# EAGLE design ExternalMotorControllerRev5 (EAGLE 6.4)

## Sheet 1 of 7
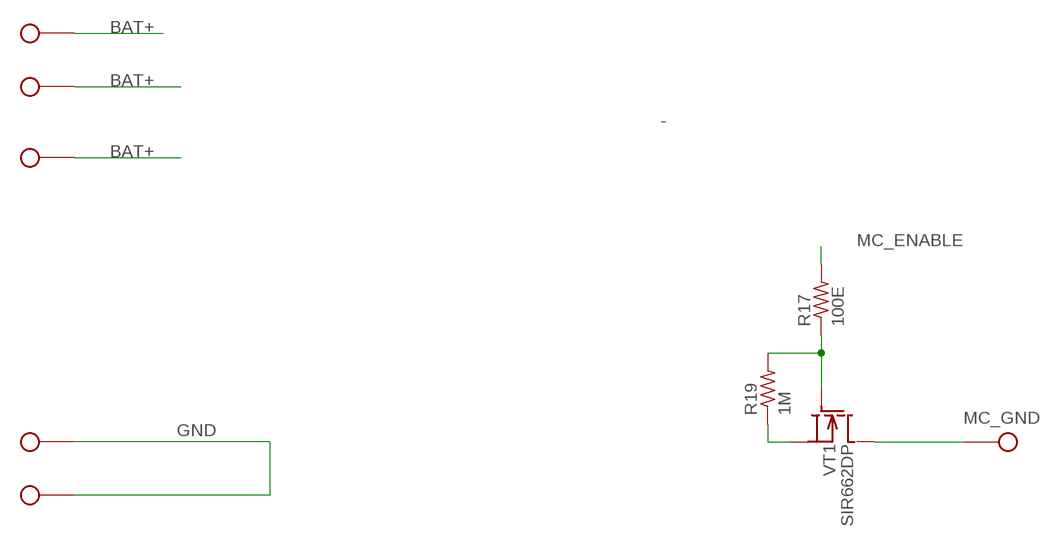
[diagram p0: schematic, sheet 1]

### Parts
R17  100E  R-US_R0402  [R0402]
R19  1M  R-US_R0402  [R0402]
VT1  SIR662DP  [POWERPAK_SO8]
X1  SOLDER_HOLE18AWG  [SOLDER_HOLE_18]
X2  SOLDER_HOLE18AWG  [SOLDER_HOLE_18]
X3  SOLDER_HOLE18AWG  [SOLDER_HOLE_18]
X4  SOLDER_HOLE18AWG  [SOLDER_HOLE_18]
X5  SOLDER_HOLE18AWG  [SOLDER_HOLE_18]
X13  SOLDER_HOLE18AWG  [SOLDER_HOLE_18]

### Nets
BAT+: X1.1 X3.1 X4.1 ; also sheet 3,7
GND: R19.1 VT1.S1(S) VT1.S2(S) VT1.S3(S) X5.1 X13.1 ; also sheet 2,3,7
MC_ENABLE: R17.2 ; also sheet 7
MC_GND: VT1.D X2.1 ; also sheet 7
N$25: R17.1 R19.2 VT1.G

## Sheet 2 of 7
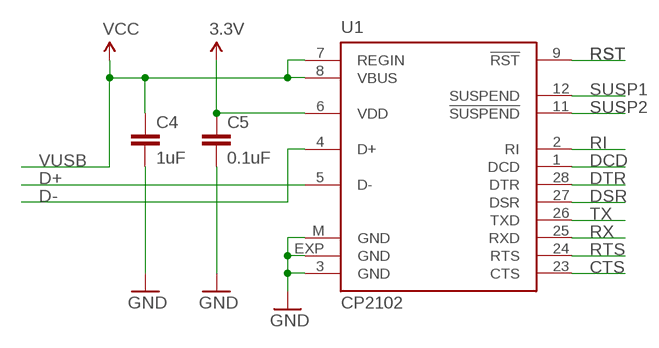
[diagram p1: schematic, sheet 2]

### Parts
C4  1uF  CAP0402  [C0402]
C5  0.1uF  CAP0402  [C0402]
U1  CP2102  CP210X_USB_UART  [MLP28]

### Nets
3.3V: C5.1 U1.6(VDD)
CTS: U1.23(CTS)
D+: U1.5(D-)
D-: U1.4(D+)
DCD: U1.1(DCD)
DSR: U1.27(DSR)
DTR: U1.28(DTR) ; also sheet 7
GND: C4.2 C5.2 U1.3(GND) U1.EXP(GND) U1.M(GND) ; also sheet 1,3,7
RI: U1.2(RI)
RST: U1.9(!RST)
RTS: U1.24(RTS)
RX: U1.25(RXD) ; also sheet 7
SUSP1: U1.12(SUSPEND)
SUSP2: U1.11(!SUSPEND)
TX: U1.26(TXD) ; also sheet 7
VUSB: C4.1 U1.7(REGIN) U1.8(VBUS) ; supply symbol labelled VCC ; also sheet 7

## Sheet 3 of 7
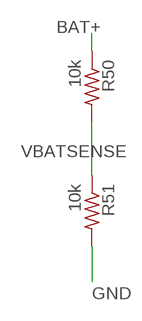
[diagram p2: schematic, sheet 3]

### Parts
R50  10k  R-US_R0402  [R0402]
R51  10k  R-US_R0402  [R0402]

### Nets
BAT+: R50.1 ; also sheet 1,7
GND: R51.2 ; also sheet 1,2,7
VBATSENSE: R50.2 R51.1 ; also sheet 7

## Sheet 4 of 7

## Sheet 5 of 7

## Sheet 6 of 7

## Sheet 7 of 7
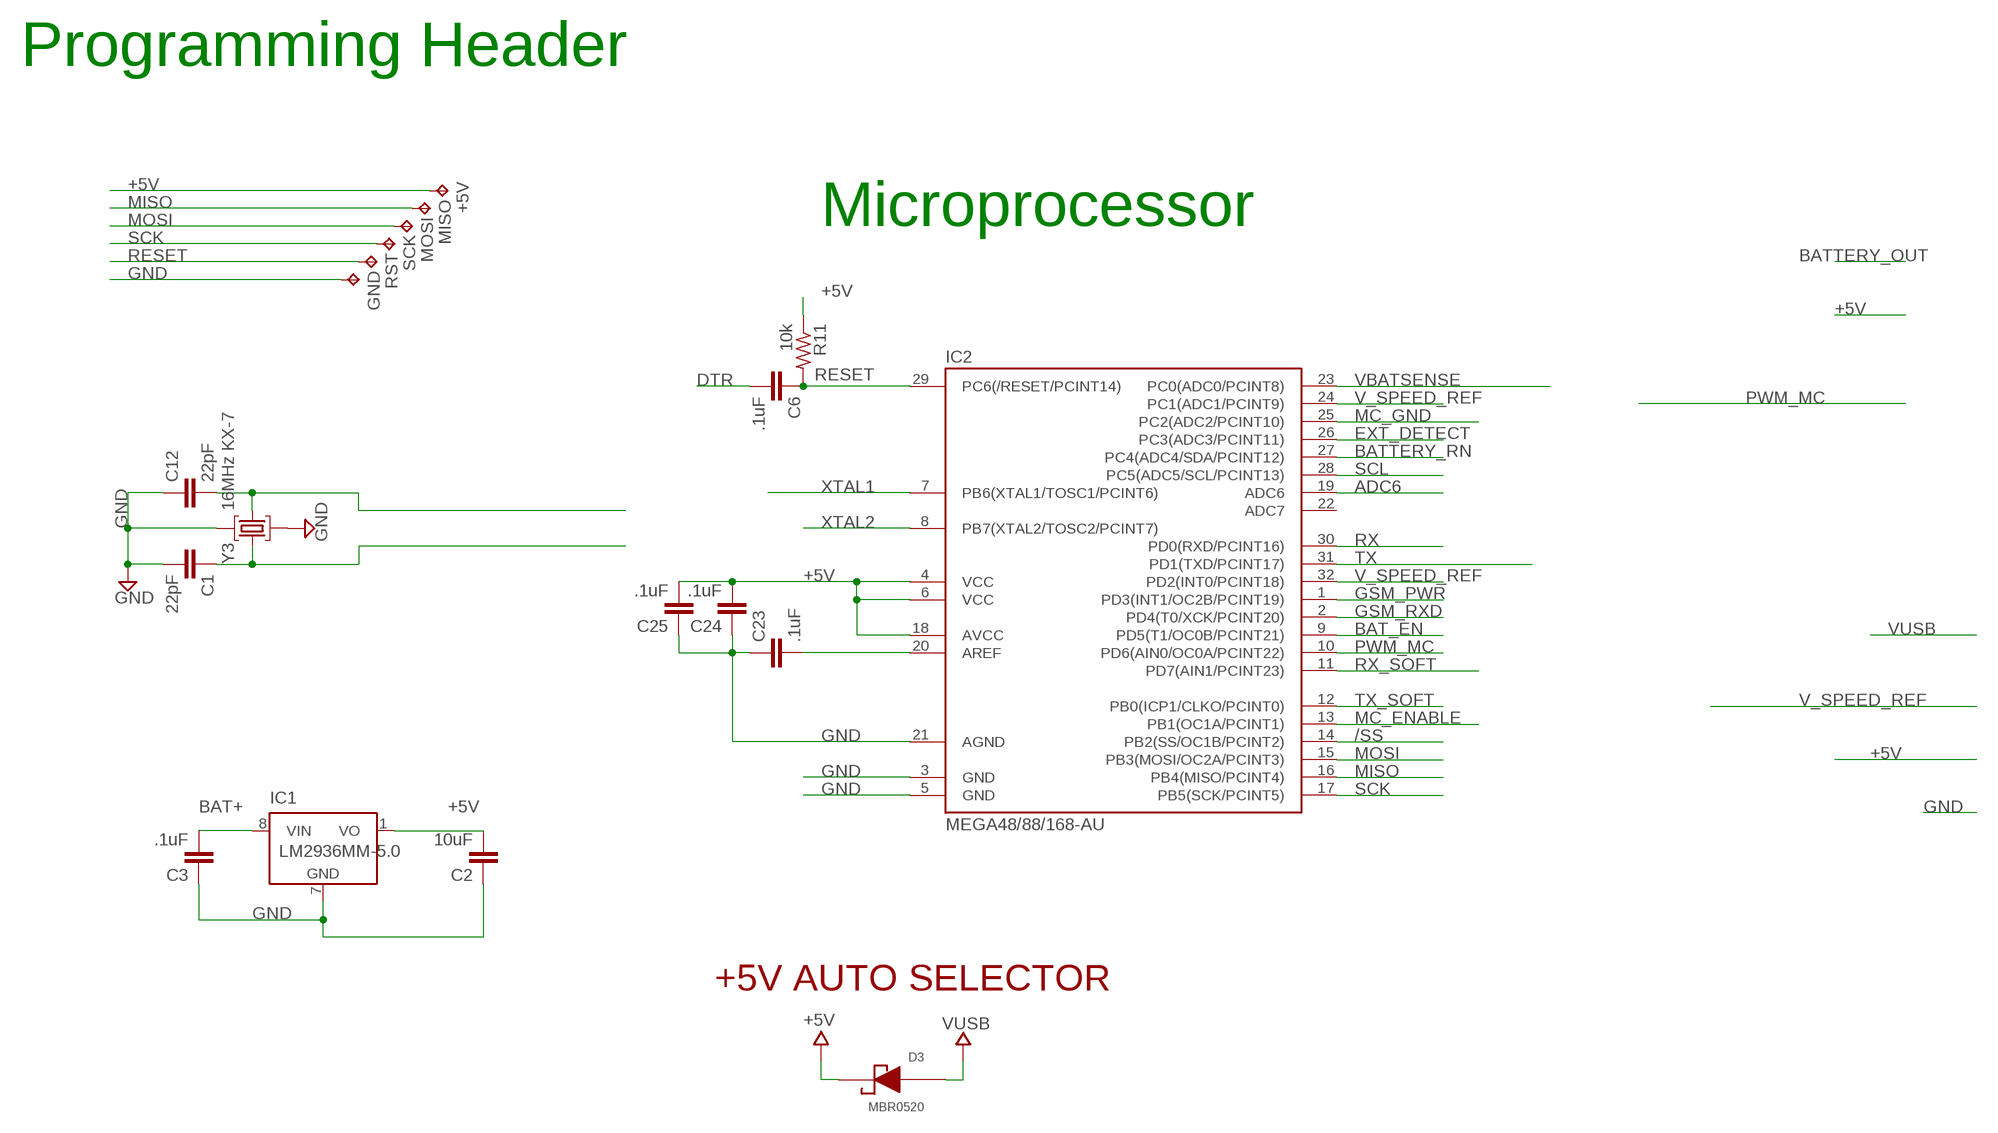
[diagram p3: schematic, sheet 7]

### Parts
+5V  TPTP08R  [TP08R]
C1  22pF  C-EUC0402  [C0402]
C2  10uF  C-EUC0805  [C0805]
C3  .1uF  C-EUC0402  [C0402]
C6  .1uF  C-EUC0402  [C0402]
C12  22pF  C-EUC0402  [C0402]
C23  .1uF  C-EUC0402  [C0402]
C24  .1uF  C-EUC0402  [C0402]
C25  .1uF  C-EUC0402  [C0402]
D3  MBR0520  [SOD-123]
GND  TPTP10R  [TP10R]
IC1  LM2936MM-5.0  [MINI-SO8]
IC2  MEGA48/88/168-AU  [TQFP32-08]
MISO  TPTP08R  [TP08R]
MOSI  TPTP08R  [TP08R]
R11  10k  R-US_R0402  [R0402]
RST  TPTP10R  [TP10R]
SCK  TPTP08R  [TP08R]
Y3  16MHz KX-7  CRYSTAL-3.2-2.5  [CRYSTAL-3.2-2.5]

### Nets
+5V: +5V.TP C2.2 C24.2 C25.2 D3.1(CA) IC1.1(VO) IC2.4(VCC) IC2.6(VCC) IC2.18(AVCC) R11.1
/SS: IC2.14(PB2(SS/OC1B/PCINT2))
ADC6: IC2.19(ADC6)
BAT+: C3.2 IC1.8(VIN) ; also sheet 1,3
BAT_EN: IC2.9(PD5(T1/OC0B/PCINT21))
BATTERY_RN: IC2.27(PC4(ADC4/SDA/PCINT12))
DTR: C6.2 ; also sheet 2
EXT_DETECT: IC2.26(PC3(ADC3/PCINT11))
GND: C1.2 C2.1 C3.1 C12.1 C23.1 C24.1 C25.1 GND.TP IC1.7(GND) IC2.3(GND) IC2.5(GND) IC2.21(AGND) Y3.2(GND) Y3.4(GND) ; also sheet 1,2,3
GSM_PWR: IC2.1(PD3(INT1/OC2B/PCINT19))
GSM_RXD: IC2.2(PD4(T0/XCK/PCINT20))
MC_ENABLE: IC2.13(PB1(OC1A/PCINT1)) ; also sheet 1
MC_GND: IC2.25(PC2(ADC2/PCINT10)) ; also sheet 1
MISO: IC2.16(PB4(MISO/PCINT4)) MISO.TP
MOSI: IC2.15(PB3(MOSI/OC2A/PCINT3)) MOSI.TP
N$36: C23.2 IC2.20(AREF)
PWM_MC: IC2.10(PD6(AIN0/OC0A/PCINT22))
RESET: C6.1 IC2.29(PC6(/RESET/PCINT14)) R11.2 RST.TP
RX: IC2.30(PD0(RXD/PCINT16)) ; also sheet 2
RX_SOFT: IC2.11(PD7(AIN1/PCINT23))
SCK: IC2.17(PB5(SCK/PCINT5)) SCK.TP
SCL: IC2.28(PC5(ADC5/SCL/PCINT13))
TX: IC2.31(PD1(TXD/PCINT17)) ; also sheet 2
TX_SOFT: IC2.12(PB0(ICP1/CLKO/PCINT0))
V_SPEED_REF: IC2.24(PC1(ADC1/PCINT9)) IC2.32(PD2(INT0/PCINT18))
VBATSENSE: IC2.23(PC0(ADC0/PCINT8)) ; also sheet 3
VUSB: D3.2(AN) ; also sheet 2
XTAL1: C12.2 IC2.7(PB6(XTAL1/TOSC1/PCINT6)) Y3.1(C1)
XTAL2: C1.1 IC2.8(PB7(XTAL2/TOSC2/PCINT7)) Y3.3(C2)
Unconnected: IC2.22(ADC7)

### Notes on the sheet
- Programming Header
- Microprocessor
- +5V AUTO SELECTOR

## Library data of the parts
+5V GND MISO MOSI RST SCK = testpad:TP: Test pad
C1-C3 C6 C23-C25 = rcl:C-EU: CAPACITOR, European symbol
C4 C5 = SparkFun:CAP: Capacitor Standard 0603 ceramic capacitor, and 0.1" leaded capacitor.
C12 = SmartPrj:C-EU: CAPACITOR, European symbol
D3 = MySMD:MBR0520
IC1 = national-semiconductor:LM2936?*: Ultra-Low Quiescent Current LDO Voltage Regulator Source: Data sheet <http://www.national.com/ds/LM/LM2936.pdf>; MF: NATIONAL SEMICONDUCTOR; MPN: LM2936MM-5.0/NOPB; OC_FARNELL: 1312707; OC_NEWARK: 41K4518
IC2 = avr-5:MEGA48/88/168
R11 R50 R51 = rcl:R-US_: RESISTOR, American symbol
R17 R19 = ForBattery:R-US_: RESISTOR, American symbol
U1 = SparkFun:CP210X_USB_UART: Single-Chip USB to UART Bridge Source: www.silabs.com .. CP2101.pdf / cp2102.pdf. Spark Fun Electronics SKU : COM-00310
VT1 = ForBattery:SIR662DP
X1-X5 X13 = ForBattery:SOLDER_HOLE
Y3 = SmartPrj:CRYSTAL-3.2-2.5

## Board
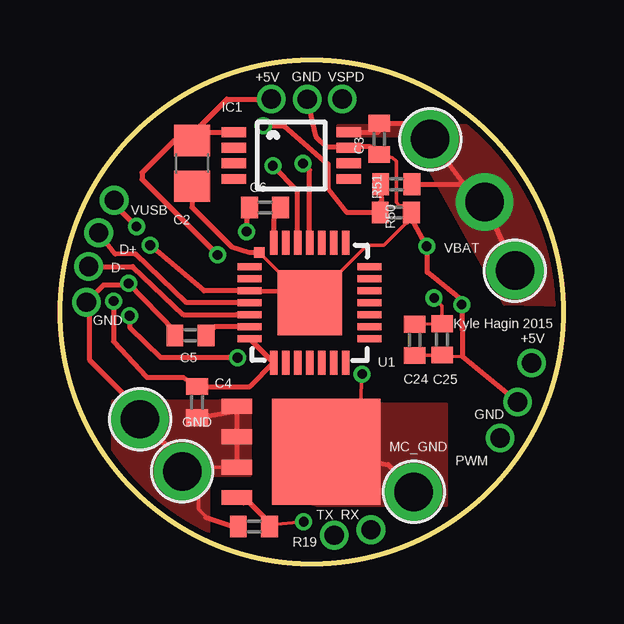
[diagram p4: board, top side]
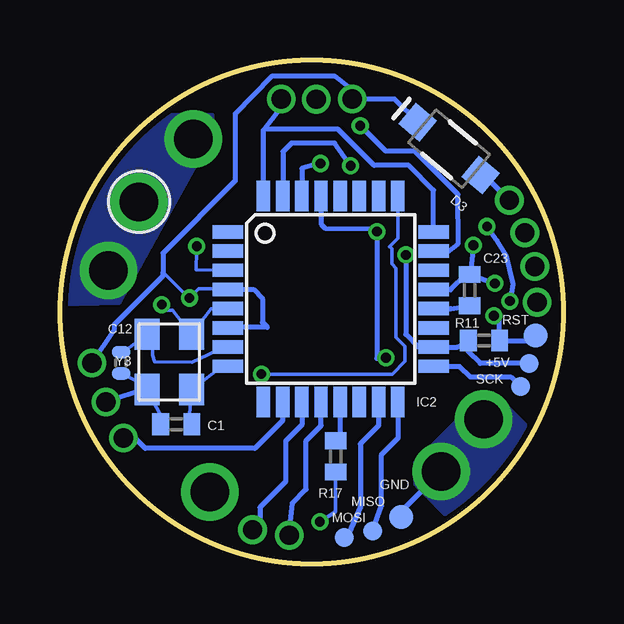
[diagram p5: board, bottom side, seen from below]

Size 21 x 21 mm. Coordinates in mm from the lower left corner, seen from the top.
Outline: circle at 10.5,10.5 radius 10.5
Copper layers (1*16): Top 0.035mm / dielectric 1.5mm / Bottom 0.035mm
Design rules "default *": minimum track width 6mil, minimum drill 16mil, track to track 6mil, track to pad 6mil, pad to pad 6mil, via to via 6mil, smd to smd 6mil, copper to edge 10mil, drill to drill 8mil, minimum pad ring 6mil, minimum via ring 6mil, stop-mask expansion 4mil, vias tented up to drill 15mil, thermal gap 10mil

### Footprints (pad centres in the part's own frame; a part is rotated, then mirrored left to right if it is on the bottom)
TP08R = smd 0.8 x 0.8: TP 0,0
C0402 = smd 0.7 x 0.9: 1 -0.65,0; 2 0.65,0
C0805 = smd 1.3 x 1.5: 1 -0.95,0; 2 0.95,0
C0402' = smd 0.508 x 0.762: 1 -0.445,0; 2 0.445,0
SOD-123 = smd 1.143 x 1.143: 1 0,0; 2 3.429,0
TP10R = smd 1 x 1: TP 0,0
MINI-SO8 = smd 0.41 x 1.02: 1 -0.975,-2.4; 2 -0.325,-2.4; 3 0.325,-2.4; 4 0.975,-2.4; 5 0.975,2.4; 6 0.325,2.4; 7 -0.325,2.4; 8 -0.975,2.4
TQFP32-08 = smd 1.27 x 0.559: 1 -4.293,2.8; 2 -4.293,2; 3 -4.293,1.2; 4 -4.293,0.4; 5 -4.293,-0.4; 6 -4.293,-1.2; 7 -4.293,-2; 8 -4.293,-2.8; 17 4.293,-2.8; 18 4.293,-2; 19 4.293,-1.2; 20 4.293,-0.4; 21 4.293,0.4; 22 4.293,1.2; 23 4.293,2; 24 4.293,2.8 | smd 0.559 x 1.27: 9 -2.8,-4.293; 10 -2,-4.293; 11 -1.2,-4.293; 12 -0.4,-4.293; 13 0.4,-4.293; 14 1.2,-4.293; 15 2,-4.293; 16 2.8,-4.293; 25 2.8,4.293; 26 2,4.293; 27 1.2,4.293; 28 0.4,4.293; 29 -0.4,4.293; 30 -1.2,4.293; 31 -2,4.293; 32 -2.8,4.293
R0402 = smd 0.7 x 0.9: 1 -0.65,0; 2 0.65,0
MLP28 = smd 1 x 0.3: 1 -2.5,1.5; 2 -2.5,1; 3 -2.5,0.5; 4 -2.5,0; 5 -2.5,-0.5; 6 -2.5,-1; 7 -2.5,-1.5; 15 2.5,-1.5; 16 2.5,-1; 17 2.5,-0.5; 18 2.5,0; 19 2.5,0.5; 20 2.5,1; 21 2.5,1.5 | smd 0.3 x 1: 8 -1.5,-2.5; 9 -1,-2.5; 10 -0.5,-2.5; 11 0,-2.5; 12 0.5,-2.5; 13 1,-2.5; 14 1.5,-2.5; 22 1.5,2.5; 23 1,2.5; 24 0.5,2.5; 25 0,2.5; 26 -0.5,2.5; 27 -1,2.5; 28 -1.5,2.5 | smd 2.7 x 2.7: EXP 0,0 | smd 0.435 x 0.435: M -2.103,2.103
POWERPAK_SO8 = smd 4.52 x 4.42: D 3.715,0 | smd 1.27 x 0.61: G 0,-1.905; S1 0,1.905; S2 0,0.635; S3 0,-0.635
SOLDER_HOLE_18 = drill 1.6: 1 0,0
CRYSTAL-3.2-2.5 = smd 1.3 x 1.05: 1 -1.15,-0.925; 2 1.15,-0.925; 3 1.15,0.925; 4 -1.15,0.925

### Placement (x,y rotation side)
+5V  1.43,8.36 0 bottom
C1  16.15,5.82 180 bottom
C2  5.51,16.69 90 top
C3  13.31,17.71 90 top
C4  5.72,6.74 270 top
C5  5.44,9.53 180 top
C6  8.55,14.85 0 top
C12  22pF  [C0402']  18.45,8.38 90 bottom
C23  3.91,11.41 270 bottom
C24  14.8,9.34 90 top
C25  15.93,9.36 90 top
D3  6.08,18.41 320 bottom
GND  6.78,1.95 0 bottom
IC1  9.64,17.02 270 top
IC2  9.71,11.04 0 bottom
MISO  7.96,1.37 0 bottom
MOSI  9.15,1.1 0 bottom
R11  3.31,9.31 0 bottom
R17  9.5,4.48 90 bottom
R19  8.09,1.57 0 top
R50  14.03,15.82 180 top
R51  14,14.64 0 top
RST  1.17,9.52 0 bottom
SCK  1.8,7.39 0 bottom
U1  10.41,10.88 0 top
VT1  7.38,4.67 0 top
X1  15.44,17.7 0 top
X2  14.75,3 0 top
X3  17.71,15.09 0 bottom
X4  18.98,12.23 0 top
X5  5.1,3.86 0 top
X13  3.34,6.03 0 top
Y3  16.44,8.42 270 bottom

### Tracks (layer width: path | path; a pad name or v marks a point on that pad's centre or on a via)
3.3V
  Top 0.203: U1.6 6.45,9.88 C5.1
+5V  (via drill 0.41, 0.8)
  Top 0.152: C24.2 15.85,10.01 C25.2 15.93,10.76 v15.6,11.08
  Top 0.203: 8.82,19.44 v8.81,19.37 6.96,19.37 5.58,18 | v6.58,12.88 3.43,16.03 3.43,16.3 4.76,17.64 C2.2 5.51,17.92 5.58,18 | 5.58,18 IC1.1
  Bottom 0.152: v8.81,19.37 8.87,19.8 | 16.7,12.15 15.64,11.08 v15.6,11.08 15.22,11.47 14.03,11.47 IC2.4
  Bottom 0.203: +5V.TP 3.48,8.36 3.97,8.85 3.97,9.42 R11.1 4.43,9.04 IC2.18 6.05,9.04 6.58,9.56 v6.58,12.88 | IC2.6 13.99,9.85 12.35,9.85 12.56,10.07 12.56,11.06 12.94,11.44 IC2.4 | 8.87,19.8 9.52,20.32 12.19,20.32 13.7,18.77 13.7,15.96 16.7,12.96 16.7,12.15 16.7,12 18.72,9.98 18.72,9.78 v19.66,8.38 | D3.1 7.05,19.37 v8.81,19.37
BAT+
  Top 0.152: 16.76,15.82 16.78,15.9
  Top 0.203: IC1.8 13.28,17.99 C3.2 14.79,18.36 X1.1 16.78,15.9 16.78,15.49 X3.1 18.98,12.17 X4.1 | R50.1 16.76,15.82
  pour Top (no thermals): 18.54,10.85 14.63,17.85 11.6,17.85 11.59,18.27 21.9,18.28 21.87,10.76
  pour Bottom (no thermals): 18.54,10.87 14.63,17.88 14.64,17.89 14.64,18.72 21.87,18.71 21.87,10.79
D+  (via drill 0.8)
  Top 0.203: v1.2,12.4 3.04,12.4 5.14,10.39 7.36,10.39 U1.5
D-  (via drill 0.8)
  Top 0.203: U1.4 5.27,10.89 3.13,12.92 2.31,12.92 v1.62,13.8
DTR
  Top 0.203: U1.28 8.94,14.71 C6.2
GND  (via drill 0.41, 0.8)
  Top 0.152: U1.M 9.92,11.36 | C3.1 13.87,16.92 14.03,16.79 14.03,15.08 14.16,14.93 14.67,14.93 R51.2 14.72,14.83 14.72,14.31 14.65,14.38 14.54,14.27 14.43,14.19 13.51,13.27 12.81,13.27 U1.EXP | R19.1 7.16,1.57 | 6.09,1.93 6.12,1.95 5.79,2.29 5.79,3.17 X5.1 5.27,4.03 VT1.S3 | 15.23,13.36 v15.3,13.24 15.32,13.25 | 16.97,10.83 v16.75,10.81 | 16.77,8.65 15.81,8.63 C25.1 14.95,8.71 C24.1
  Top 0.203: VT1.S3 VT1.S2 VT1.S1 7.3,6.35 C4.2 | X5.1 5.17,3.93 5.17,4.2 X13.1 3.34,6.72 3.01,6.72 1.24,8.49 1.24,10.77 v1.1,10.91 1.82,11.62 2.98,11.62 3.11,11.48 | 4.79,9.84 C5.2 4.79,9.7 v2.86,11.69 | v2.86,11.69 3.11,11.48 | 13.52,17.09 13.52,16.92 C3.1 13.41,16.92 12.96,17.38 12.08,17.38 IC1.7 12.01,17.38 11.12,17.38 10.66,17.83 v10.31,19.37 | v2.86,11.69 2.8,11.63 3.11,11.48 | U1.EXP 9.92,11.36 U1.3 6.01,11.38 v3.76,13.28 | 14.76,14.92 R51.2 | C2.1 5.51,14.86 7.15,13.22 7.89,12.99 U1.M | 7.16,1.57 6.09,1.93 | 15.23,13.36 14.65,14.38 | 16.97,10.83 15.32,12.15 15.32,13.25 | v16.75,10.81 16.77,8.65 v19.09,6.75
  Bottom 0.152: C1.2 16.77,6.15 Y3.2 17.36,7.3 17.36,7.4 C12.1 | IC2.5 14.7,10.64 Y3.4 | 15.71,9.91 Y3.4 | 15.31,13.29 v15.3,13.24 15.3,13.06 15.31,12.26 14.42,12.24 IC2.3 | 16.7,10.81 v16.75,10.81 16.54,10.58 16.29,10.58 Y3.4
  Bottom 0.203: GND.TP 6.78,2.18 X5.1 | C23.1 4.07,12.06 4.71,11.42 5.4,11.42 IC2.21 | 1.31,11.12 v1.1,10.91 | C23.1 v2.86,11.69 | v3.76,13.28 3.9,12.08 C23.1 | 17.36,7.3 v19.09,6.75
  pour Top (no thermals): 6.21,-0.26 6.21,3.7 7.92,3.7 7.92,6.79 2.19,6.79 2.19,-0.2 4.81,-0.2
  pour Bottom (no thermals): 2.93,7.12 3.32,7.12 6.21,4.23 6.21,3.31 4.5,1.61 3.55,1.61 1.27,3.89 1.27,5.5 2.75,6.97
MC_ENABLE
  Bottom 0.203: IC2.13 9.31,5.32 R17.2
MC_GND  (via drill 0.41)
  Top 0.152: VT1.D 11.1,6.27 12.51,6.26 v12.6,7.91
  Top 0.203: VT1.D 13.68,4.14 X2.1
  Bottom 0.152: IC2.25 6.91,13.57 7.27,13.21 7.23,13.2 7.16,13.13 7.16,12.51 6.98,12.33 6.98,9.46 6.61,9.08 6.61,8.44 7.14,7.91 v12.6,7.91 12.61,8
  pour Top (no thermals): 10.44,2.54 10.44,6.65 16.11,6.65 16.11,2.46 10.72,2.46
MISO
  Bottom 0.203: MISO.TP 7.76,1.96 7.59,2.42 7.59,4.55 6.89,5.25 6.89,6.72 IC2.16
MOSI
  Bottom 0.203: IC2.15 7.71,5.77 8.48,5.01 8.48,2.38 8.95,1.3 9.14,1.23 MOSI.TP
N$25  (via drill 0.41)
  Top 0.152: v10.17,1.76 8.8,1.63 | 8.8,1.63 R19.2 | 8.8,1.63 8.8,1.66 | 7.92,2.52 7.65,2.51 VT1.G
  Top 0.203: 8.8,1.66 7.92,2.52
  Bottom 0.152: R17.1 9.5,2.18 v10.17,1.76
N$36
  Bottom 0.203: IC2.20 4.7,10.64 C23.2
PWM_MC  (via drill 0.8)
  Bottom 0.203: IC2.10 11.71,5.98 12.88,4.81 17.45,4.81 17.88,5.25 v18.35,5.25
RESET  (via drill 0.41)
  Top 0.203: v7.79,13.85 7.82,14.54 C6.1 | v2.91,10.34 2.91,9.86 4.2,8.6 7.26,8.61 v7.4,8.6
  Bottom 0.203: 1.24,9.46 RST.TP 1.39,9.31 R11.2 2.71,10.44 v2.91,10.34 | IC2.29 10.11,14.16 9.95,14 7.83,13.98 v7.79,13.85 7.79,8.55 arc90 v7.4,8.6
RX  (via drill 0.41)
  Top 0.203: U1.25 10.41,16.41 v10.14,16.69
  Bottom 0.203: v10.14,16.69 10.3,16.66 10.91,16.49 IC2.30
RX_SOFT  (via drill 0.8)
  Bottom 0.203: IC2.11 10.91,5.8 11.59,5.12 11.59,3.43 12.66,2.36 12.66,1.76 v12.97,1.42
SCK
  Bottom 0.203: IC2.17 4.34,8.24 3.89,7.79 2.2,7.79 SCK.TP
TX  (via drill 0.41)
  Top 0.203: 8.89,16.58 8.87,16.61 v8.88,16.6 9.91,15.56 U1.26
  Bottom 0.203: v8.88,16.6 9.55,17.54 10.08,17.54 11.35,17.54 11.7,17.19 11.7,15.34 IC2.31
TX_SOFT  (via drill 0.8)
  Bottom 0.203: v11.44,1.19 11.3,2.54 10.73,3.11 10.73,5.14 10.11,5.77 IC2.12
V_SPEED_REF  (via drill 0.8)
  Bottom 0.203: IC2.32 12.51,18.07 | 12.51,18.07 11.6,19.27 v11.77,19.38 | IC2.24 5.42,15.58 6.45,16.61 7.9,16.61 9.41,18.12 12.47,18.12 12.51,18.07
VBATSENSE  (via drill 0.41)
  Top 0.152: 13.38,14.92 R51.1 | 13.38,15.07 13.17,14.66
  Top 0.203: v8.48,18.26 9.35,18.27 11.18,16.67 11.18,15.64 11.95,14.66 13.17,14.66 | 13.17,14.66 13.26,14.8 | R50.2 13.41,14.76 13.17,14.66 | 13.38,14.92 13.38,15.07
  Bottom 0.203: IC2.23 4.84,12.99 4.39,13.34 4.4,15.4 6.19,17.2 7.41,17.2 v8.48,18.26
VUSB  (via drill 0.41, 0.8)
  Top 0.203: U1.7 U1.8 7.92,7.39 C4.1 5.14,7.78 3.62,7.78 2.23,9.26 v2.24,10.95 | v2.26,15.15 2.26,15 v3.19,14.06
  Bottom 0.203: v3.19,14.06 2.77,13.47 2.41,12.86 2.11,11.66 v2.24,10.95 | D3.2 3.31,16.2 v2.26,15.15
XTAL1
  Bottom 0.152: IC2.7 14.48,8.88 15.5,8.4 17.04,8.42 17.13,8.7 17.13,9.48 Y3.1 18.36,8.83 C12.2
XTAL2
  Bottom 0.152: IC2.8 14.24,8.24 Y3.3 15.63,5.74 C1.1

### Text on the board
tNames: +5V | GND | VSPD | VUSB | D+ | VBAT | D- | GND | Kyle Hagin 2015 | +5V | GND | GND | MC_GND | PWM | TX | RX